# Altium schematic sheet 01-MCU.SchDoc
size 246 x 182 mm
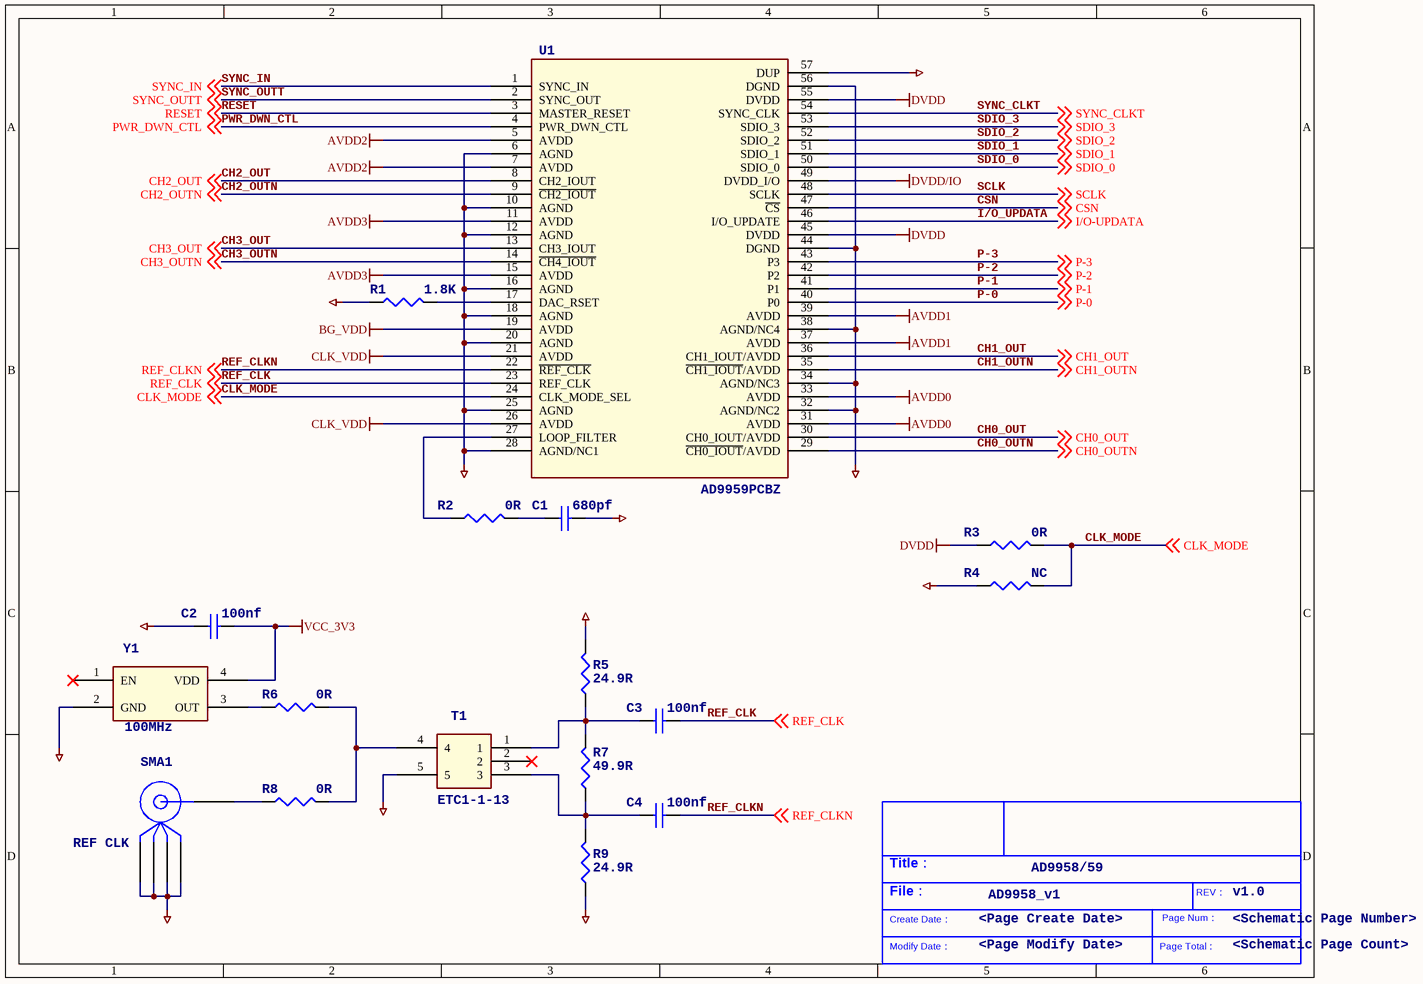
[diagram p0: 01-MCU.SchDoc]

## Parts
*  Schematic Page Count: <Schematic Page Count>  Schematic Page Number: <Schematic Page Number>  Page Modify Date: <Page Modify Date>  Page Create Date: <Page Create Date>  Revcode: v1.0  File: AD9958_v1  Title: AD9958/59  (hidden comment: My_Title_Block)  (graphical)
C1  680pf  [0603C]
C2  100nf  [0603C]
C3  100nf  [0603C]
C4  100nf  [0603C]
R1  1.8K  [0603R]
R2  0R  [0603R]
R3  0R  [0603R]
R4  NC  [0603R]
R5  24.9R  [0603R]
R6  0R  [0603R]
R7  49.9R  [0603R]
R8  0R  [0603R]
R9  24.9R  [0603R]
SMA1  REF CLK  [CON10-5R1X5R1]
T1  ETC1-1-13  [SM-22]
U1  AD9959PCBZ  [QFN50P800X800X100-56M]
Y1  100MHz  [XTAL-SMD-7050_4P]

## Nets
AGND: C1.2 C2.1 R1.1 R4.1 R5.2 R9.1 SMA1.2(GND) SMA1.3(GND) SMA1.4(GND) SMA1.5(GND) T1.5 U1.6(AGND) U1.10(AGND) U1.12(AGND) U1.16(AGND) U1.18(AGND) U1.20(AGND) U1.25(AGND) U1.28(AGND/NC1) U1.32(AGND/NC2) U1.34(AGND/NC3) U1.38(AGND/NC4) U1.44(DGND) U1.56(DGND) U1.57(DUP) Y1.2(GND)
AVDD0: U1.31(AVDD) U1.33(AVDD)
AVDD1: U1.37(AVDD) U1.39(AVDD)
AVDD2: U1.5(AVDD) U1.7(AVDD)
AVDD3: U1.11(AVDD) U1.15(AVDD)
BG_VDD: U1.19(AVDD)
CLK_VDD: U1.21(AVDD) U1.26(AVDD)
DVDD: R3.1 U1.45(DVDD) U1.55(DVDD)
DVDD/IO: U1.49(DVDD_I/O)
VCC_3V3: C2.2 Y1.4(VDD)
CH0_OUT: U1.30(CH0_IOUT/AVDD) ; off-sheet CH0_OUT
CH0_OUTN: U1.29(~{CH0_IOUT}/AVDD) ; off-sheet CH0_OUTN
CH1_OUT: U1.36(CH1_IOUT/AVDD) ; off-sheet CH1_OUT
CH1_OUTN: U1.35(~{CH1_IOUT}/AVDD) ; off-sheet CH1_OUTN
CH2_OUT: U1.8(CH2_IOUT) ; off-sheet CH2_OUT
CH2_OUTN: U1.9(~{CH2_IOUT}) ; off-sheet CH2_OUTN
CH3_OUT: U1.13(CH3_IOUT) ; off-sheet CH3_OUT
CH3_OUTN: U1.14(~{CH4_IOUT}) ; off-sheet CH3_OUTN
CLK_MODE: R3.2 R4.2 U1.24(CLK_MODE_SEL) ; off-sheet CLK_MODE
CSN: U1.47(~{CS}) ; off-sheet CSN
I/O_UPDATA: U1.46(I/O_UPDATE) ; off-sheet I/O-UPDATA  [also labelled I/O-UPDATA]
P-0: U1.40(P0) ; off-sheet P-0
P-1: U1.41(P1) ; off-sheet P-1
P-2: U1.42(P2) ; off-sheet P-2
P-3: U1.43(P3) ; off-sheet P-3
PWR_DWN_CTL: U1.4(PWR_DWN_CTL) ; off-sheet PWR_DWN_CTL
REF_CLK: C3.2 U1.23(REF_CLK) ; off-sheet REF_CLK
REF_CLKN: C4.2 U1.22(~{REF_CLK}) ; off-sheet REF_CLKN
RESET: U1.3(MASTER_RESET) ; off-sheet RESET
SCLK: U1.48(SCLK) ; off-sheet SCLK
SDIO_0: U1.50(SDIO_0) ; off-sheet SDIO_0
SDIO_1: U1.51(SDIO_1) ; off-sheet SDIO_1
SDIO_2: U1.52(SDIO_2) ; off-sheet SDIO_2
SDIO_3: U1.53(SDIO_3) ; off-sheet SDIO_3
SYNC_CLKT: U1.54(SYNC_CLK) ; off-sheet SYNC_CLKT
SYNC_IN: U1.1(SYNC_IN) ; off-sheet SYNC_IN
SYNC_OUTT: U1.2(SYNC_OUT) ; off-sheet SYNC_OUTT
NetC1_1: C1.1 R2.2
NetC3_1: C3.1 R5.1 R7.2 T1.1
NetC4_1: C4.1 R7.1 R9.2 T1.3
NetR1_2: R1.2 U1.17(DAC_RSET)
NetR2_1: R2.1 U1.27(LOOP_FILTER)
NetR6_1: R6.1 Y1.3(OUT)
NetR6_2: R6.2 R8.2 T1.4
NetR8_1: R8.1 SMA1.1

Not connected (* = marked no-connect by the designer): T1 2*; Y1 1(EN)*

## Notes on the sheet
- (in symbol My_Title_Block) Title：; REV：; File：; Create Date：; Page Num：; Modify Date：; Page Total：

## Library data of the parts
* = My_Title_Block: Company Name: 东莞理工学院; Page Count: 4; Page Number: 1
C1-C4 = CAP NP
R1-R9 = R
SMA1 = BNC
U1 = AD9958BCPZ_2
Y1 = XTAL_SMD